# Altium schematic sheet Embedded_Circuits.SchDoc
size A; SheetNumber: 3; SheetTotal: 9
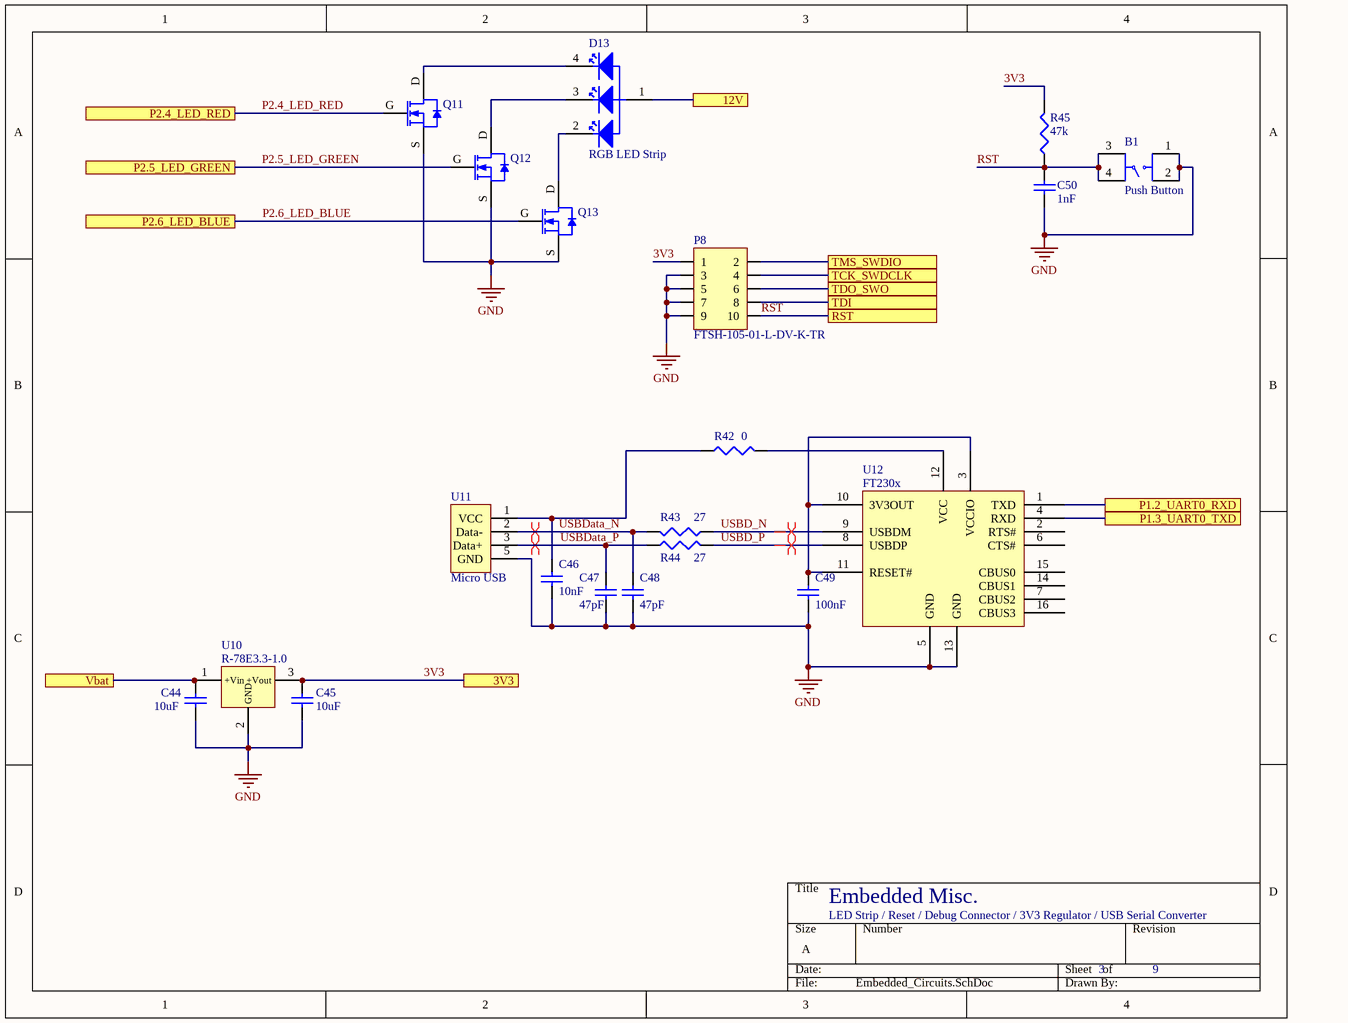
[diagram p0: Embedded_Circuits.SchDoc]

## Parts
B1  Push Button  [Push Button]
C44  value 10uF  [C1206]  (hidden comment: Cap)
C45  value 10uF  [C1206]  (hidden comment: Cap)
C46  value 10nF  [C1206]  (hidden comment: Cap)
C47  value 47pF  [C1206]  (hidden comment: Cap)
C48  value 47pF  [C1206]  (hidden comment: Cap)
C49  value 100nF  [C1206]  (hidden comment: Cap)
C50  value 1nF  [C1206]  (hidden comment: Cap Semi)
D13  RGB LED Strip  [Header 1x4]
P8  FTSH-105-01-L-DV-K-TR  [FTSH-105-01-L-DV-K-TR]
Q11  DMN1019USN  [DMN1019USN]  (value not drawn)
Q12  DMN1019USN  [DMN1019USN]  (value not drawn)
Q13  DMN1019USN  [DMN1019USN]  (value not drawn)
R42  value 0  [J1-0603]  (hidden comment: Res3)
R43  value 27  [J1-0603]  (hidden comment: Res3)
R44  value 27  [J1-0603]  (hidden comment: Res3)
R45  value 47k  [J1-0603]  (hidden comment: Res3)
U10  R-78E3.3-1.0  [R-78Exx-1.0]
U11  Micro USB  [Micro USB]
U12  FT230x  [FT230X]

## Ports
3V3, 12V, P1.2_UART0_RXD, P1.3_UART0_TXD, P2.4_LED_RED, P2.5_LED_GREEN, P2.6_LED_BLUE, RST, TCK_SWDCLK, TDI, TDO_SWO, TMS_SWDIO, Vbat

## Nets
GND: B1.1 B1.2 C44.1 C45.1 C46.1 C47.1 C48.1 C49.1 C50.1 P8.3 P8.5 P8.7 P8.9 Q11.S Q12.S Q13.S U10.2(GND) U11.5(GND) U12.5(GND) U12.13(GND)
3V3: C45.2 P8.1 R45.2 U10.3(+Vout) ; port 3V3
12V: D13.1 ; port 12V
P1.2_UART0_RXD: U12.1(TXD) ; port P1.2_UART0_RXD
P1.3_UART0_TXD: U12.4(RXD) ; port P1.3_UART0_TXD
P2.4_LED_RED: Q11.G ; port P2.4_LED_RED
P2.5_LED_GREEN: Q12.G ; port P2.5_LED_GREEN
P2.6_LED_BLUE: Q13.G ; port P2.6_LED_BLUE
RST: B1.3 B1.4 C50.2 P8.10 R45.1 ; port RST
TCK_SWDCLK: P8.4 ; port TCK_SWDCLK
TDI: P8.8 ; port TDI
TDO_SWO: P8.6 ; port TDO_SWO
TMS_SWDIO: P8.2 ; port TMS_SWDIO
USBD_N: R43.1 U12.9(USBDM)
USBD_P: R44.2 U12.8(USBDP)
USBData_N: C48.2 R43.2 U11.2(Data-)
USBData_P: C47.2 R44.1 U11.3(Data+)
Vbat: C44.2 U10.1(+Vin) ; port Vbat
NetC46_2: C46.2 R42.1 U11.1(VCC)
NetC49_2: C49.2 U12.3(VCCIO) U12.10(3V3OUT) U12.11(RESET#)
NetD13_2: D13.2 Q13.D
NetD13_3: D13.3 Q12.D
NetD13_4: D13.4 Q11.D
NetR42_2: R42.2 U12.12(VCC)

Not connected (* = marked no-connect by the designer): U12 2(RTS#) 6(CTS#) 7(CBUS2) 14(CBUS1) 15(CBUS0) 16(CBUS3)

## Layout directives
differential pair: USBD_N, USBD_P, USBData_N, USBData_P

## Notes on the sheet
- Embedded Misc.
- LED Strip / Reset / Debug Connector / 3V3 Regulator / USB Serial Converter

## Library data of the parts
B1 = Push Button: Tactile Switch SPST-NO Top Actuated Through Hole; Digikey Link: https://www.digikey.com/product-detail/en/te-connectivity-alcoswitch-switches/FSM101/450-1157-ND/701084; Drawing: https://www.te.com/commerce/DocumentDelivery/DDEController?Action=srchrtrv&DocNm=1571140&DocType=Customer+Drawing&DocLang=English
C44-C49 = Cap: Capacitor; Published: 8-Jun-2000; LatestRevisionDate: 17-Jul-2002; LatestRevisionNote: Re-released for DXP Platform.; PackageReference: RAD-0.3; Publisher: Altium Limited; PackageDescription: Radial Cap, Thru-Hole; 2 Leads; 0.3 in Pin Spacing; Supplier 1: Digi-Key
  C44 C45: Supplier Part Number 1: 1276-2872-1-ND
  C46: Supplier Part Number 1: 1276-1921-1-ND
  C47 C48: Supplier Part Number 1: 490-16375-1-ND
  C49: Supplier Part Number 1: 1276-1001-1-ND
C50 = Cap Semi: Capacitor (Semiconductor SIM Model); Published: 8-Jun-2000; LatestRevisionDate: 29-May-2009; LatestRevisionNote: IPC-7351 Footprint Added.; PackageReference: C1206; Publisher: Altium Limited; PackageDescription: Chip Capacitor; Supplier 1: Digi-Key; Supplier Part Number 1: 490-4761-1-ND
D13 = RGB LED Strip: LED RGB Strip - Bare Nonaddressable; Sparkfun Link: https://www.sparkfun.com/products/12021
P8 = JTAG Header: CONN HEADER 10POS DUAL .05" SMD; Digikey Link: https://www.digikey.com/product-detail/en/samtec-inc/FTSH-105-01-L-DV-K-TR/SAM13165CT-ND/8827920; Drawings: http://suddendocs.samtec.com/prints/ftsh-1xx-xx-xxx-dv-xxx-xxx-mkt.pdf; Datasheet: http://suddendocs.samtec.com/catalog_english/ftsh_smt.pdf
Q11-Q13 = DMN1019USN: 12V N-Channel Enhancement Mode MOSFET; Datasheet: https://www.diodes.com/assets/Datasheets/DMN1019USN.pdf
R42-R45 = Res3: Resistor; Published: 8-Jun-2000; LatestRevisionDate: 29-May-2009; LatestRevisionNote: IPC-7351 Footprint Added.; PackageReference: J1-0603; Publisher: Altium Limited; PackageDescription: Chip Resistor
U10 = R-78Exx-1.0: 1A DC/DC Voltage Converter; Datasheet: https://www.recom-power.com/pdf/Innoline/R-78Exx-0.5.pdf
U11 = Micro USB: USB - micro B USB 2.0 Receptacle Connector 5 Position Surface Mount, Right Angle; Digikey: https://www.digikey.com/product-detail/en/molex-llc/1050170001/WM1399CT-ND/2350885; Datasheet: https://www.molex.com/pdm_docs/sd/1050170001_sd.pdf
U12 = FTDI FT230x: USB to Basic UART IC; Datasheet: https://www.ftdichip.com/Support/Documents/DataSheets/ICs/DS_FT230X.pdf